# Altium schematic sheet Power supply.SchDoc
size A4; DocumentNumber: 14; SheetNumber: ALT0056; SheetTotal: 21
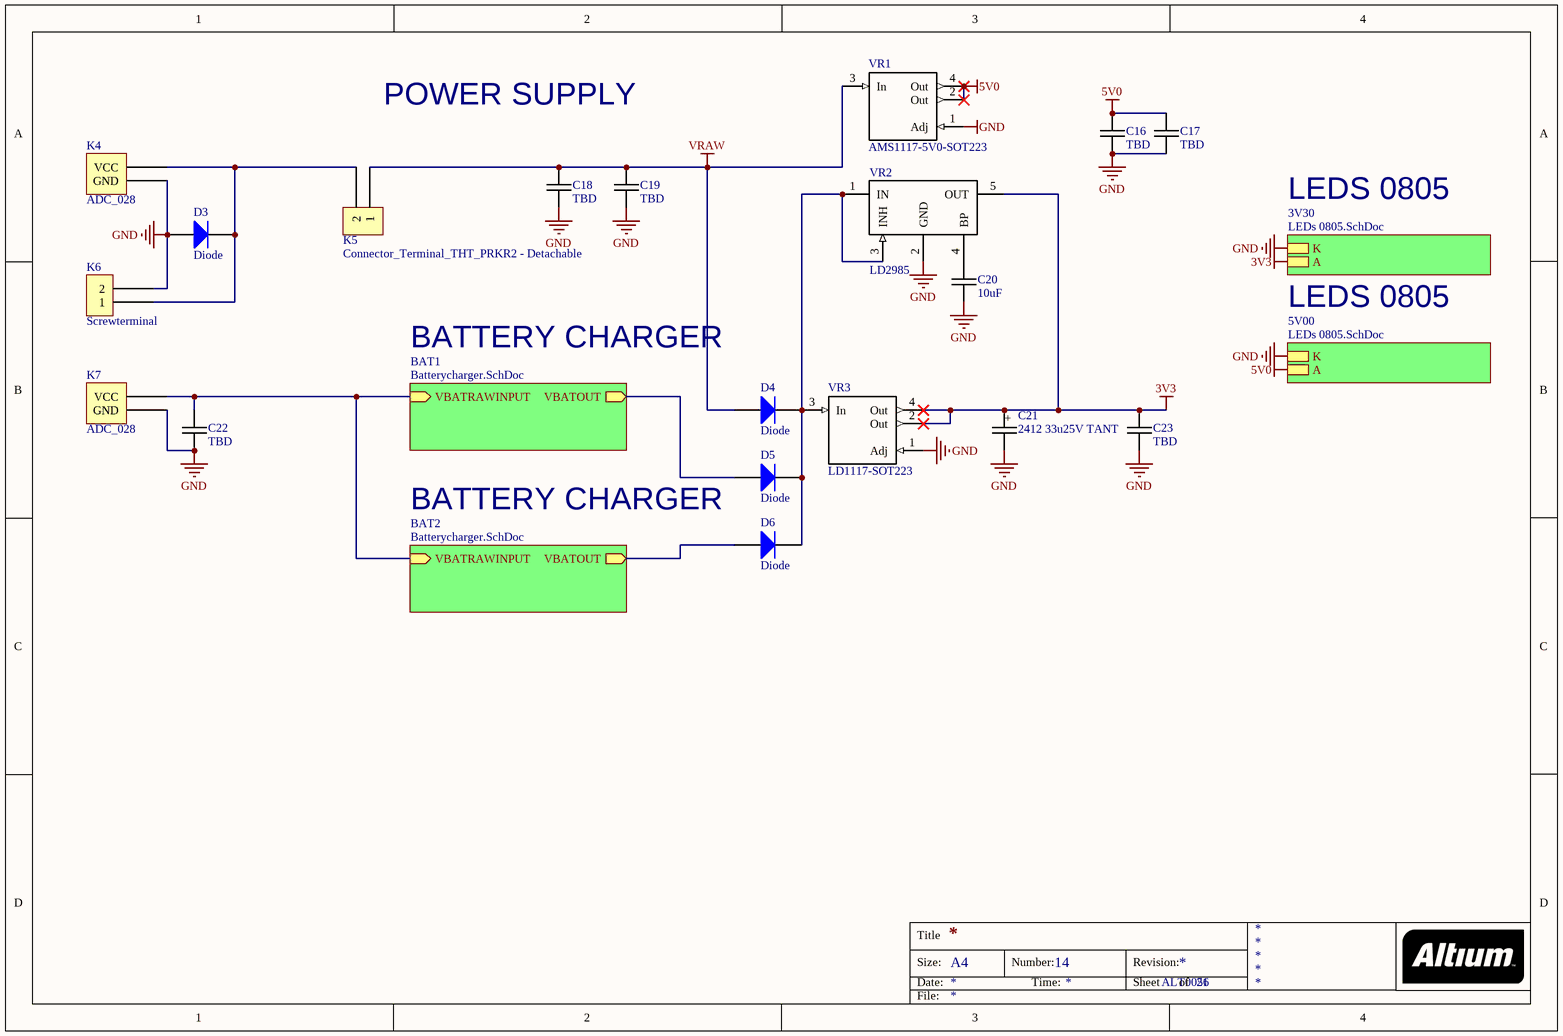
[diagram p0: Power supply.SchDoc]

## Parts
C16  TBD  [1210C-GENERIC]
C17  TBD  [1210C-GENERIC]
C18  TBD  [1210C-GENERIC]
C19  TBD  [1210C-GENERIC]
C20  10uF  [0603C-GENERIC]
C21  2412 33u25V TANT  [2412C+_TANTAL-33u25V]
C22  TBD  [1210C-GENERIC]
C23  TBD  [1210C-GENERIC]
D3  Diode  [SMB]
D4  Diode  [SMB]
D5  Diode  [SMB]
D6  Diode  [SMB]
K4  ADC_028  [ADC-028]
K5  Connector_Terminal_THT_PRKR2 - Detachable  [PRKR2-DET]
K6  Screwterminal  [PRKR2-DET]
K7  ADC_028  [ADC-028]
VR1  AMS1117-5V0-SOT223  [SOT223]
VR2  LD2985  [SOT23-5]
VR3  LD1117-SOT223  [SOT223]

## Sub-sheets
3V30 = LEDs 0805.SchDoc: K, A
5V00 = LEDs 0805.SchDoc: K, A
BAT1 = Batterycharger.SchDoc: VBATOUT (out), VBATRAWINPUT (in)
BAT2 = Batterycharger.SchDoc: VBATOUT (out), VBATRAWINPUT (in)

## Nets
3V3: C21.1 C23.1 VR2.5(OUT) VR3.2(Out) VR3.4(Out) ; sheet 3V30/A
5V0: C16.1 C17.1 VR1.2(Out) VR1.4(Out) ; sheet 5V00/A
GND: C16.2 C17.2 C18.2 C19.2 C20.2 C21.2 C22.2 C23.2 D3.1(A) K4.GND K6.2 K7.GND VR1.1(Adj) VR2.2(GND) VR3.1(Adj) ; sheet 3V30/K, sheet 5V00/K
VRAW: C18.1 C19.1 D4.1(A) K5.1 VR1.3(In)
NetC20_1: C20.1 VR2.4(BP)
NetC22_1: C22.1 K7.VCC ; sheet BAT1/VBATRAWINPUT, sheet BAT2/VBATRAWINPUT
NetD3_2: D3.2(K) K4.VCC K5.2 K6.1
NetD4_2: D4.2(K) D5.2(K) D6.2(K) VR2.1(IN) VR2.3(INH) VR3.3(In)
NetD5_1: D5.1(A) ; sheet BAT1/VBATOUT
NetD6_1: D6.1(A) ; sheet BAT2/VBATOUT

## Notes on the sheet
- POWER SUPPLY
- LEDS 0805
- BATTERY CHARGER
- Title
- Size:
- Date:
- A4
- Number:
- Time:
- Revision:
- Sheet
- of
- File:
- (in symbol 2412C-TANTAL SIZE C-33u25V) +

## Library data of the parts
C16-C19 C22 C23 = Passives_Capacitors_1210_1210C-TBD: CAPACITOR 1210 CERAMIC VALUE TO BE DETERMINED
C20 = 0603C-10UF-10V-X5R-TDK: CAPACITOR 0603 CERAMIC; Manufacturer Part Number: C1608X5R0J106M; Manufacturer: TDK Corporation; Reel: C31; Supplier 1: Digi-Key; Supplier Part Number 1: 445-4112-2-ND
C21 = 2412C-TANTAL SIZE C-33u25V
D3-D6 = Diode: Default Diode; Published: 8-Jun-2000; LatestRevisionDate: 17-Jul-2002; LatestRevisionNote: Re-released for DXP Platform.; PackageVersion: Sep-1996; PackageReference: SMC; Publisher: Altium Limited; PackageDescription: DO-214-AB/SMC; 2 C-Bend Leads; Body 7.9 x 5.9 mm, inc. leads (LxW); Code_JEDEC: DO-214-AB
K4 K7 = ADC_028: 5.5mm SMD
K6 = Connector_Terminal_THT_PRKR2 - Detachable
VR1 = LD1117-SOT223
VR2 = LD2985: Low Noise Low Drop Voltage Regulator  with Inhibit; Text Field1: ST; Text Field2: LK112SM33TR; Text Field3: ST; Text Field4: LK112SM33TR